# EasyEDA Pro project ESP32_xiaoneisai_20260831.epro

# Schematic Schematic1
Assembly Variant: Basic; Board Name: Board1; Create Date: 2026-04-24; Page Name: P1; Project Name: CAN_ESP32; Schematic Name: Schematic1; Update Date: 2026-04-24; Company: 嘉立创EDA; Page Size: A4; Version: V1.0
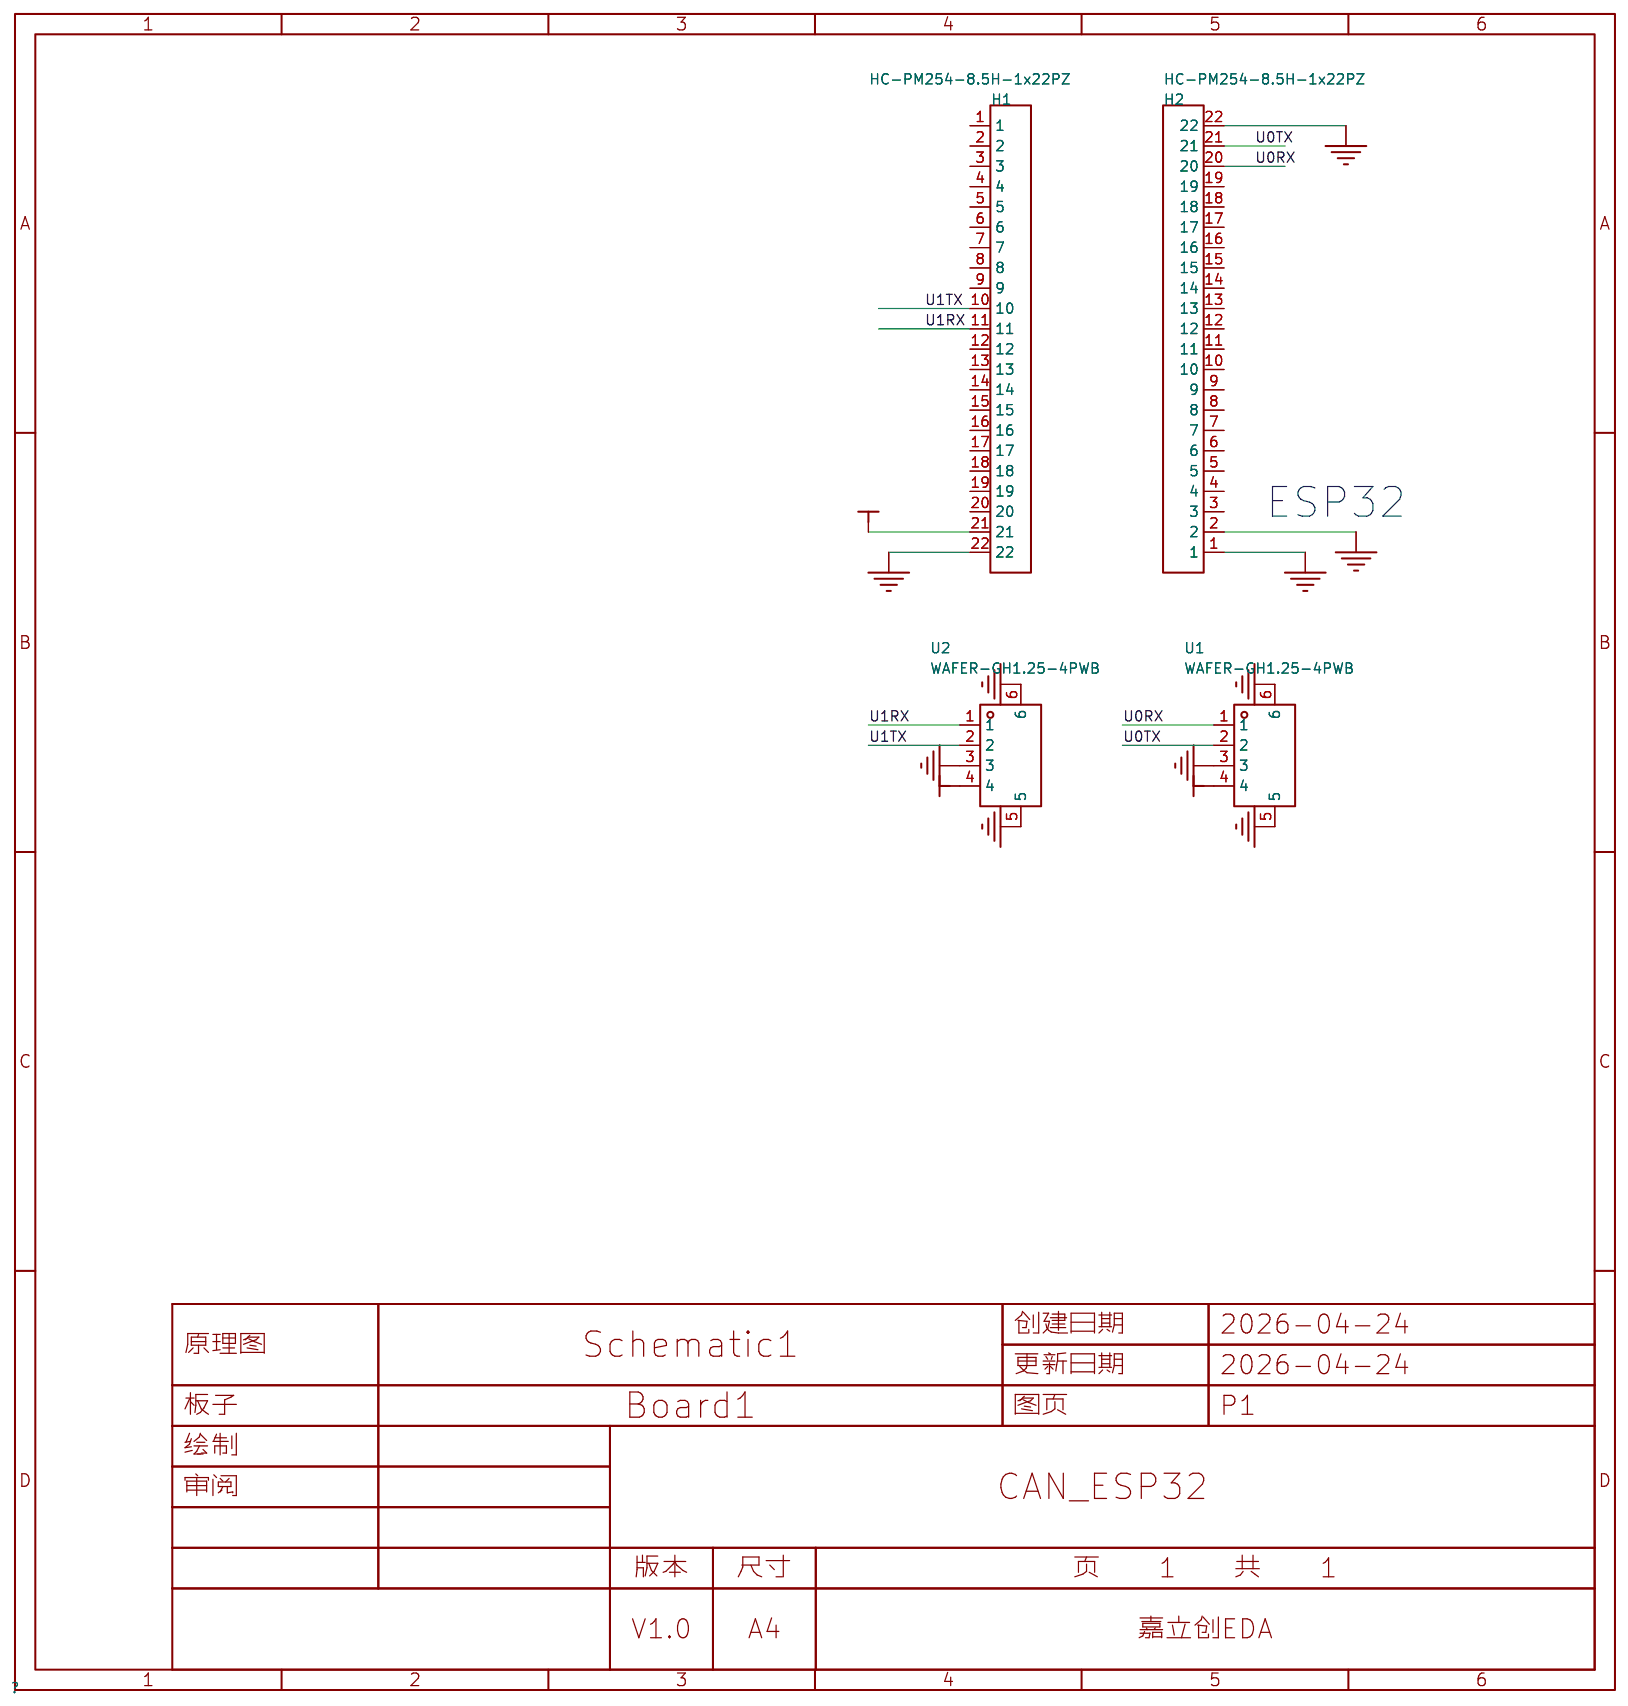
[diagram p0: schematic sheet]

## Parts
H1  HC-PM254-8.5H-1x22PZ  [HDR-TH_22P-P2.54-V-F]
H2  HC-PM254-8.5H-1x22PZ  [HDR-TH_22P-P2.54-V-F]
U1  WAFER-GH1.25-4PWB  [CONN-SMD_4P-P1.25_XUNPU_WAFER-GH1.25-4PWB]
U2  WAFER-GH1.25-4PWB  [CONN-SMD_4P-P1.25_XUNPU_WAFER-GH1.25-4PWB]

## Library data of the parts
H1 H2 = HC-PM254-8.5H-1x22PZ: 插孔结构:1x22P;间距:2.54mm;行距:-;圆孔/方孔:方孔;安装方式:直插;排数:单排;总孔位数:22P;额定电流:3A;额定电压:-;插孔方向:顶部;塑高:8.5mm;触头材质:黄铜;触头镀层:金;工作温度:-40℃~+105℃;; LCSC Part Name: 间距2.54mm 1x22Pin 直插 PC3.0 H8.5; Supplier Part: C41376161; Manufacturer: HC(虹成电子); Supplier Footprint: 插件,P=2.54mm; JLCPCB Part Class: Extended Part; Datasheet: https://item.szlcsc.com/datasheet/HC-PM254-8.5H-1x22PZ/43143860.html; Supplier: LCSC; Holes Structure: 1x22P; Pitch: 2.54mm; Circular Hole / Square Hole: 方孔; Mounting Type: 直插; Number of Rows: 单排; Number of Positions: 22P; Current Rating: 3A; Holes Direction: 顶部; Insulation Height: 8.5mm; Contact Material: 黄铜; Contact Plating: 金; Operating Temperature: -40℃~+105℃; PIN Length: 3mm
U1 U2 = WAFER-GH1.25-4PWB: 插针结构:1x4P;间距:1.25mm;安装方式:卧贴;参考系列:GH;总PIN数:4P;排数:1;每排PIN数:4;行距:-;额定电流:1A;触头材质:黄铜;触头镀层:锡;工作温度:-25℃~+85℃;; LCSC Part Name: 1x4P 间距:1.25mm 卧贴 系列:GH; Supplier Part: C3029379; Manufacturer: XUNPU(讯普); Supplier Footprint: SMD,P=1.25mm,卧贴; JLCPCB Part Class: Extended Part; Datasheet: https://item.szlcsc.com/datasheet/WAFER-GH1.25-4PWB/3561391.html; Supplier: LCSC; Pins Structure: 1x4P; Pitch: 1.25mm; Mounting Type: 卧贴; Reference Series: GH; Number of Pins: 4P; Number of Rows: 1; Number of PINs Per Row: 4; Current Rating: 1A; Contact Material: 黄铜; Contact Plating: 锡; Operating Temperature: -25℃~+85℃; Voltage Rating: 125V; Plastic Material: LCP; Supplementary Features: 辅助焊脚; Color: 米色; Z-Height of the Board: 4.35mm; X-Length of Bottom Edge on Board (Spacing Line): 8.25mm; Y-Width of Bottom Edge on Board: 5mm

## Nets
GND: H1.22 H2.1 H2.2 H2.22 U1.3 U1.5 U1.6 U2.3 U2.5 U2.6
VCC_5V: H1.21 U1.4 U2.4
U0RX: H2.20 U1.1
U0TX: H2.21 U1.2
U1RX: H1.11 U2.1
U1TX: H1.10 U2.2

Not connected (* = marked no-connect by the designer): H1 1 2 3 4 5 6 7 8 9 12 13 14 15 16 17 18 19 20; H2 3 4 5 6 7 8 9 10 11 12 13 14 15 16 17 18 19

## Notes on the sheet
- ESP32

# Board PCB1
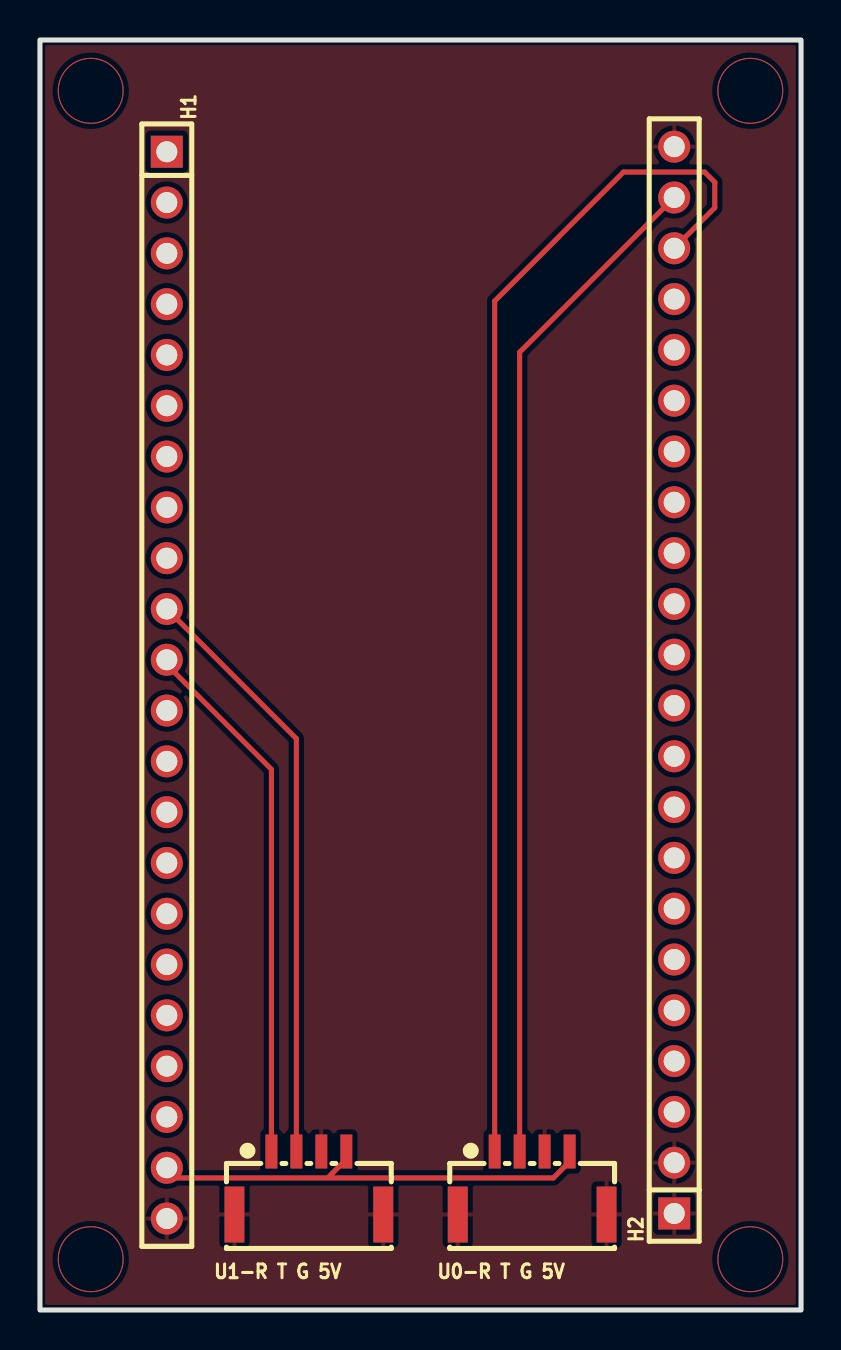
[diagram p1: board, top side]
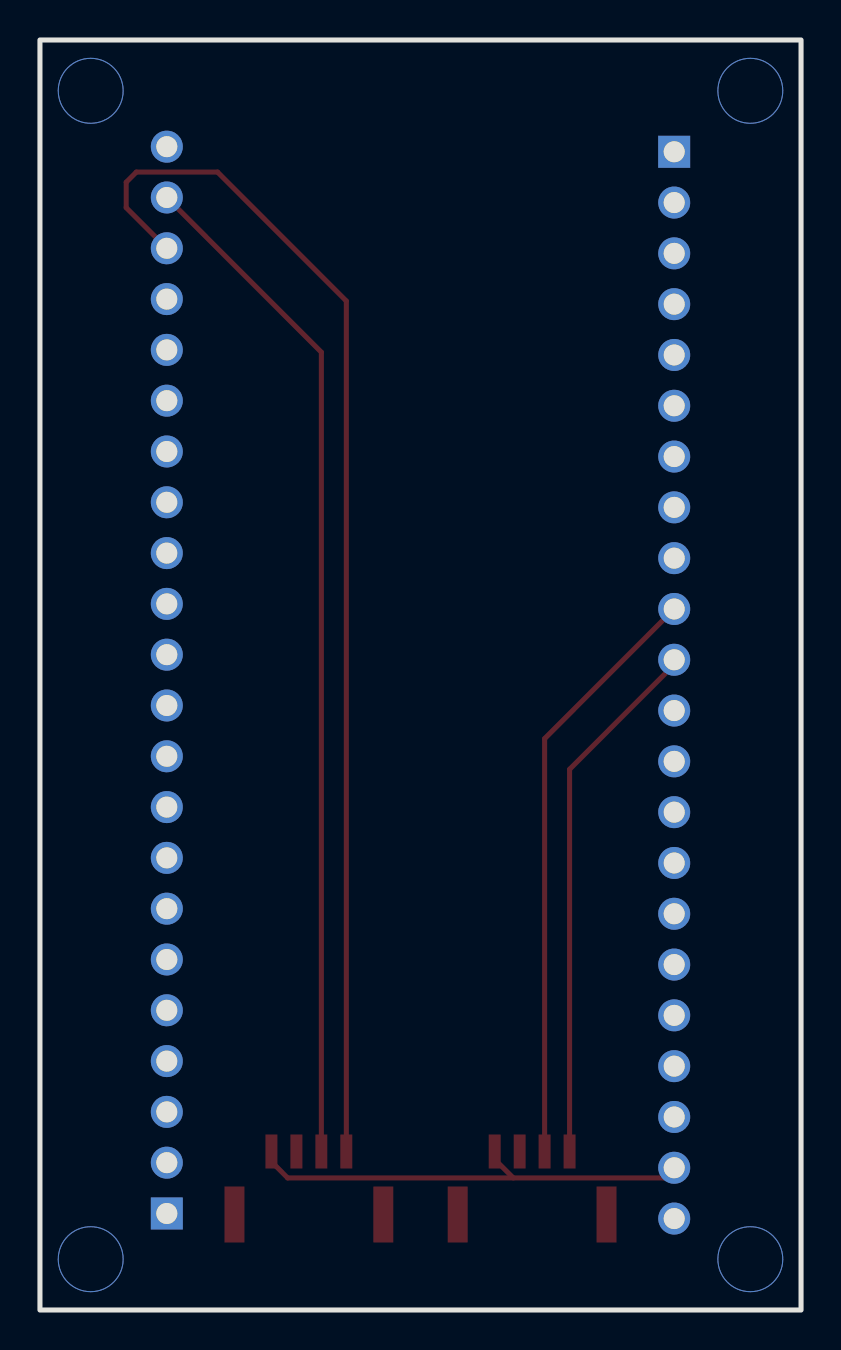
[diagram p2: board, bottom side, seen from below]

Outline 38.1 x 63.5 mm; copper layers: Top Layer, Bottom Layer. Coordinates in mm from the lower left corner of the outline.
Outline path: rectangle 0,63.5 38.1,0
Stack: Top Layer 0.035mm / Dielectric1 1.51mm FR4 er 4.5 / Bottom Layer 0.035mm

## Design rules (mm)
spacing copperThickness1oz (default): track to track 0.102, other pairs 0.152 to 0.3
spacing copperThickness2oz: track to track 0.203, other pairs 0.152 to 0.3
track width copperThickness1oz (default): min 0.127, default 0.254, max 2.54
track width copperThickness2oz: min 0.203, default 0.254, max 2.54
differential pair differentialPair (default): width min 0.127, default 0.254, max 2.54; gap min 0.152, default 0.152
net GND uses copperRegion

## Placement (name value [footprint] x y rotation side)
H1  HC-PM254-8.5H-1x22PZ  [HDR-TH_22P-P2.54-V-F]  6.35 31.24 270 top
H2  HC-PM254-8.5H-1x22PZ  [HDR-TH_22P-P2.54-V-F]  31.75 31.5 90 top
U0-R T G 5V  WAFER-GH1.25-4PWB  [CONN-SMD_4P-P1.25_XUNPU_WAFER-GH1.25-4PWB]  24.64 6.35 0 top
U1-R T G 5V  WAFER-GH1.25-4PWB  [CONN-SMD_4P-P1.25_XUNPU_WAFER-GH1.25-4PWB]  13.46 6.35 0 top

## Footprints (pads in the part's own frame, mm; a bottom-side part is the same pattern mirrored in y, then rotated)
CONN-SMD_4P-P1.25_XUNPU_WAFER-GH1.25-4PWB
  rect 0.6x1.7 smd: 1(-1.875,1.575) 2(-0.625,1.575) 3(0.625,1.575) 4(1.875,1.575)
  rect 1x2.8 smd: 5(3.725,-1.575) 6(-3.725,-1.575)
HDR-TH_22P-P2.54-V-F
  rect 1.6x1.6 hole 1.05: 1(-26.67,0)
  round 1.6 hole 1.05: 2(-24.13,0) 3(-21.59,0) 4(-19.05,0) 5(-16.51,0) 6(-13.97,0) 7(-11.43,0) 8(-8.89,0) 9(-6.35,0) 10(-3.81,0) 11(-1.27,0) 12(1.27,0) 13(3.81,0) 14(6.35,0) 15(8.89,0) 16(11.43,0) 17(13.97,0) 18(16.51,0) 19(19.05,0) 20(21.59,0) 21(24.13,0) 22(26.67,0)

## Nets
GND: H1.22 H2.1 H2.2 H2.22 U0-R T G 5V.3 U0-R T G 5V.5 U0-R T G 5V.6 U1-R T G 5V.3 U1-R T G 5V.5 U1-R T G 5V.6
VCC_5V: H1.21 U0-R T G 5V.4 U1-R T G 5V.4
U0RX: H2.20 U0-R T G 5V.1
U0TX: H2.21 U0-R T G 5V.2
U1RX: H1.11 U1-R T G 5V.1
U1TX: H1.10 U1-R T G 5V.2

Pads without a net: H1 1 2 3 4 5 6 7 8 9 12 13 14 15 16 17 18 19 20; H2 3 4 5 6 7 8 9 10 11 12 13 14 15 16 17 18 19

## Via types
v1: diameter 3.3, hole 3.2, Top Layer to Bottom Layer, 4 vias

## Routing (per net, layer and track width the routed paths; a pad name or vN(x,y) marks a point on that pad's centre or on a via; arc(x,y) is an arc through that point)
VCC_5V: length 22.9
  Top Layer w0.254: U1-R T G 5V.4 15.34,7.54 14.4,6.6 ; H1.21 6.86,6.6 25.7,6.6 26.51,7.42 U0-R T G 5V.4
(no net):
  vias: v1(2.54,60.96) v1(2.54,2.54) v1(35.56,60.96) v1(35.56,2.54)
U0RX: length 60.6
  Top Layer w0.254: U0-R T G 5V.1 22.76,50.45 29.21,56.9 33.27,56.9 33.78,56.39 33.78,55.12 H2.20
U0TX: length 50.9
  Top Layer w0.254: U0-R T G 5V.2 24.01,47.89 H2.21
U1RX: length 26.5
  Top Layer w0.254: 6.35,32.27 11.59,27.03 U1-R T G 5V.1
U1TX: length 29.8
  Top Layer w0.254: H1.10 12.84,28.57 U1-R T G 5V.2

## Copper pours and planes (outline as drawn; the poured copper is in the pictures)
GND on Top Layer: 0,63.5 38.1,63.5 38.1,0 0,0
